# EasyEDA Pro project ProPrj_GesturePot_2025-03-16.epro

# Schematic GesPot
Board Name: GesPot; Create Date: 2025-03-15; Page Name: P2; Project Name: GesturePot; Schematic Name: GesPot; Update Date: 2025-03-15; Company: 嘉立创EDA; Page Size: A4; Version: V1.0
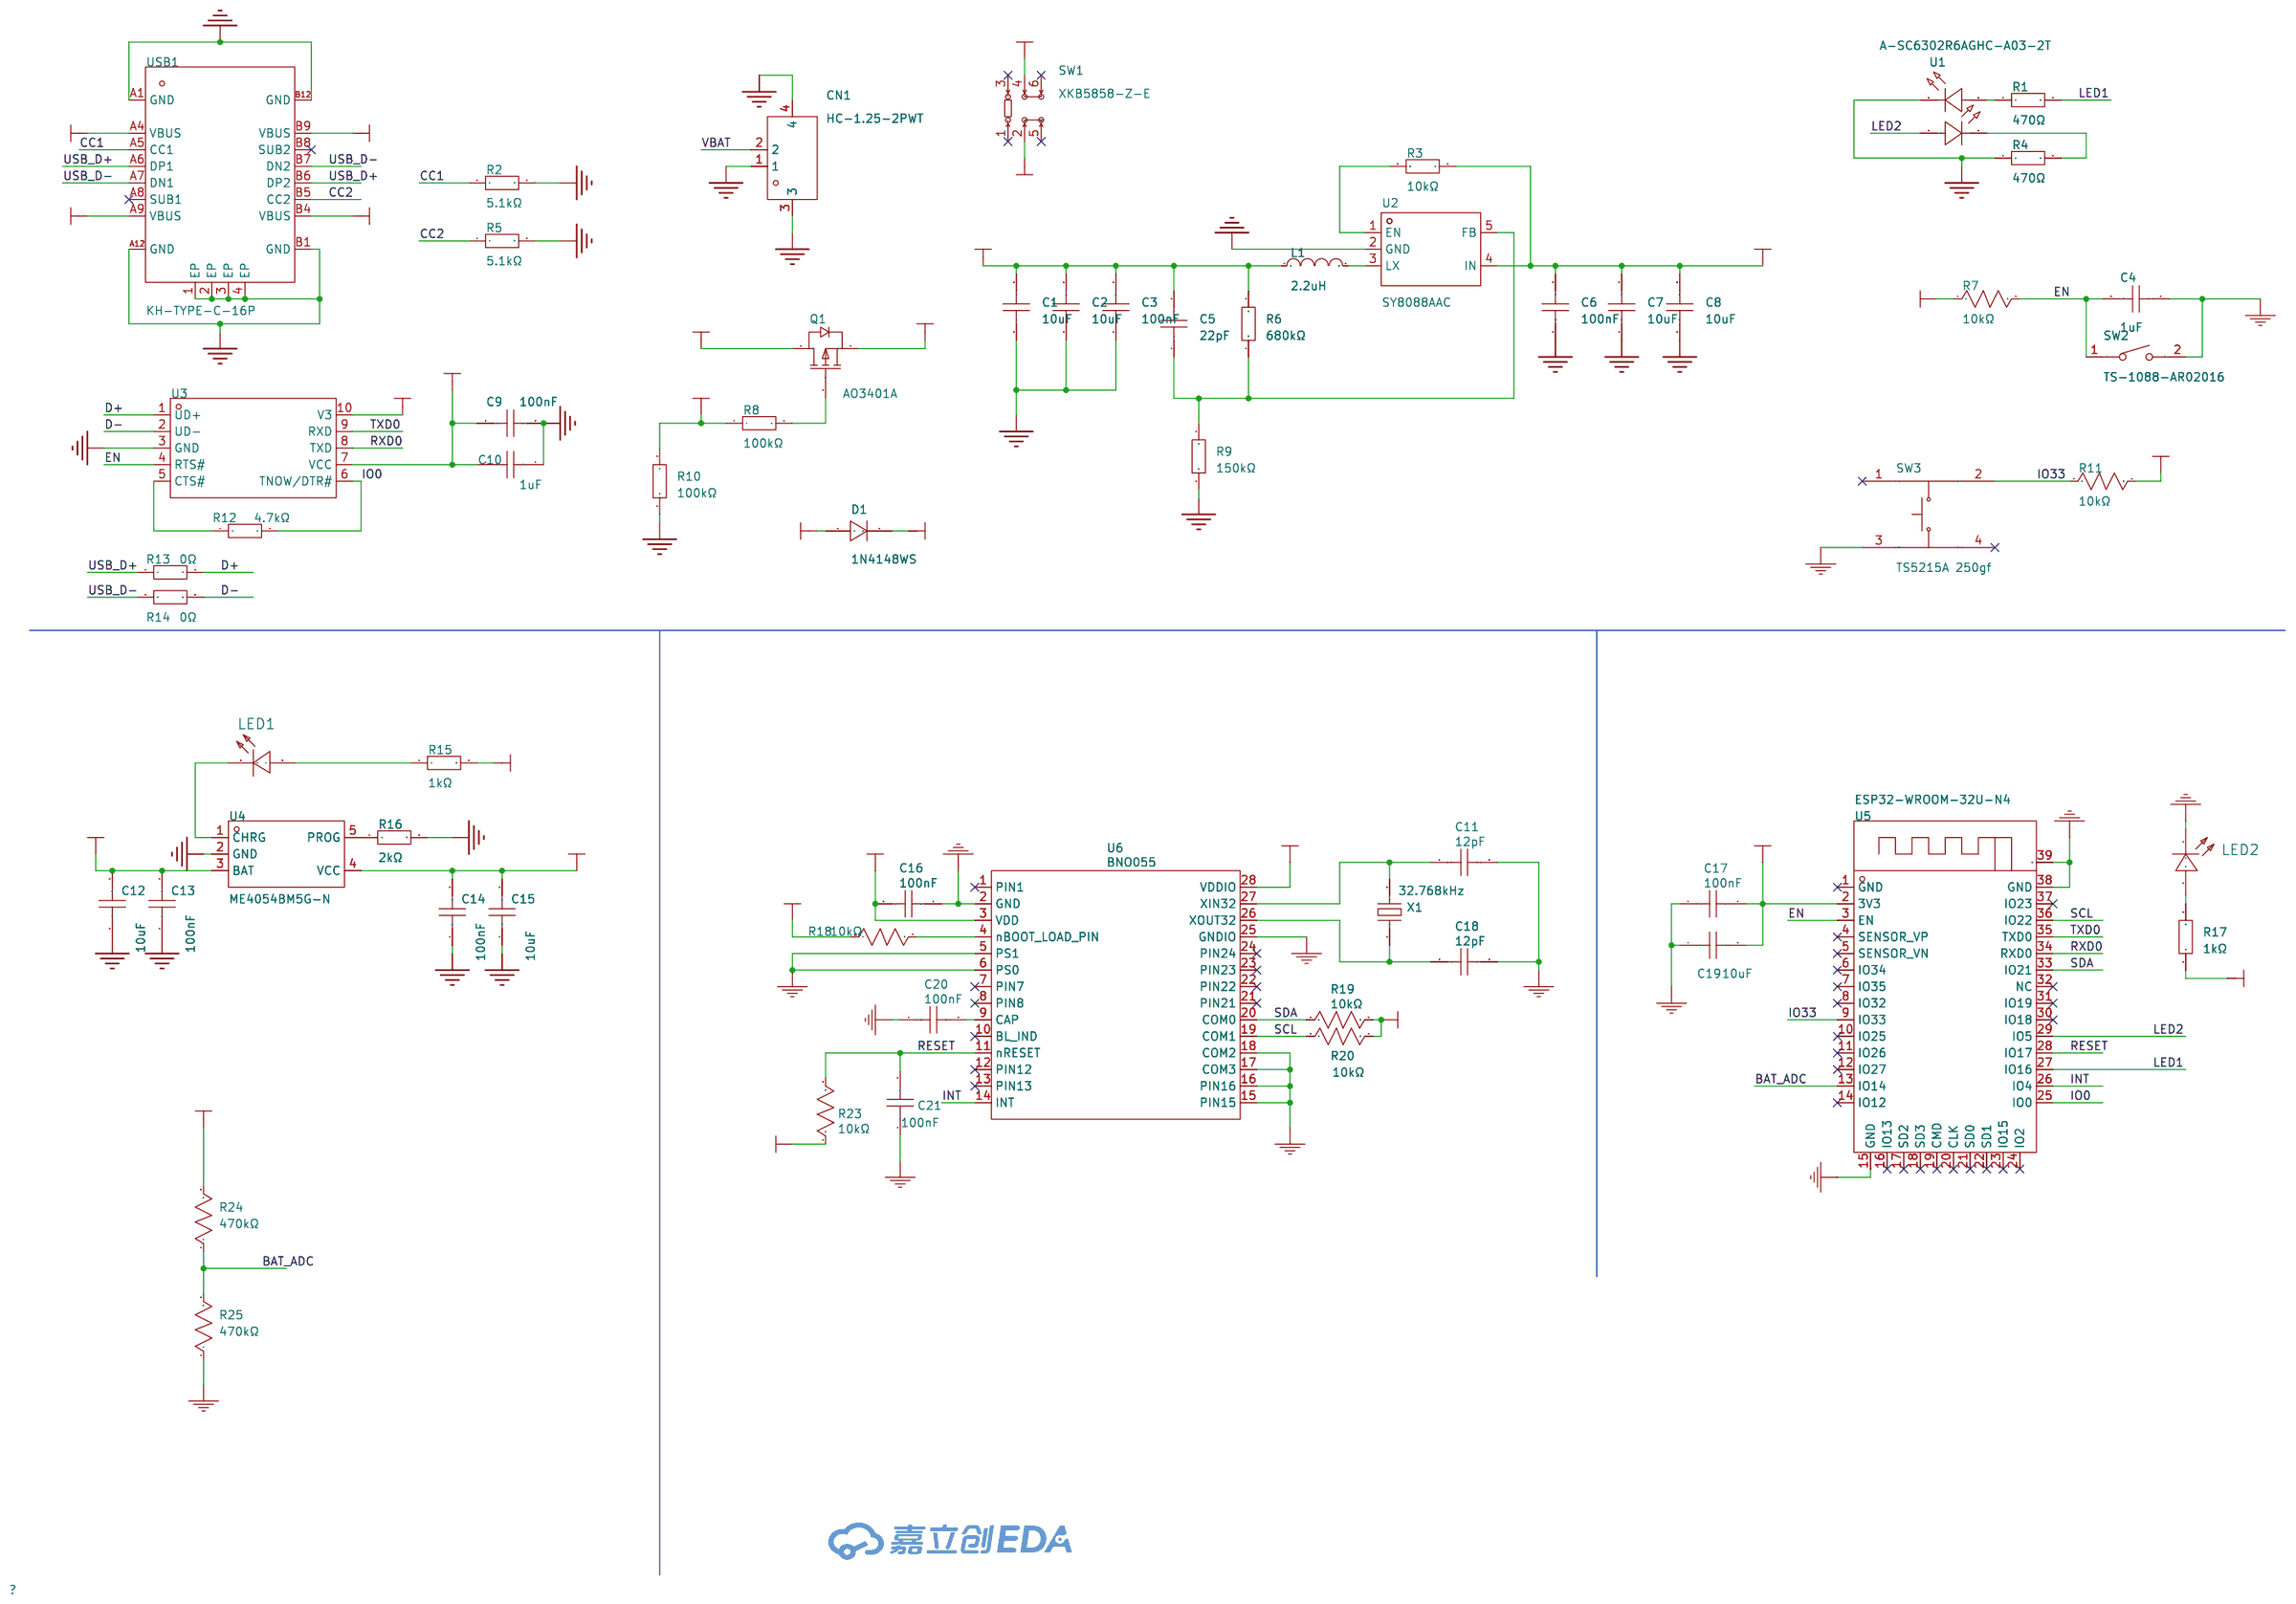
[diagram p0: schematic sheet]

## Parts
C1  10uF  [C0603]
C2  10uF  [C0603]
C3  100nF  [C0402]
C4  1uF  [C0402]
C5  22pF  [C0603]
C6  100nF  [C0402]
C7  10uF  [C0603]
C8  10uF  [C0603]
C9  100nF  [C0402]
C10  1uF  [C0402]
C11  12pF  [C0402]
C12  10uF  [C0603]
C13  100nF  [C0402]
C14  100nF  [C0402]
C15  10uF  [C0603]
C16  100nF  [C0402]
C17  100nF  [C0402]
C18  12pF  [C0402]
C19  10uF  [C0402]
C20  100nF  [C0402]
C21  100nF  [C0402]
CN1  HC-1.25-2PWT  [CONN-SMD_2P-P1.25-HC-1.25-2PWT]
D1  1N4148WS  [SOD-323_L1.8-W1.3-LS2.5-RD]
L1  2.2uH  [L0603]
LED1  KT-0603R  [LED0603-RD]
LED2  KT-0603R  [LED0603-RD]
Q1  AO3401A  [SOT-23_L2.9-W1.3-P1.90-LS2.4-BR]
R1  470Ω  [R0402]
R2  5.1kΩ  [R0402]
R3  10kΩ  [R0402]
R4  470Ω  [R0402]
R5  5.1kΩ  [R0402]
R6  680kΩ  [R0402]
R7  10kΩ  [R0402]
R8  100kΩ  [R0402]
R9  150kΩ  [R0402]
R10  100kΩ  [R0402]
R11  10kΩ  [R0402]
R12  4.7kΩ  [R0402]
R13  0Ω  [R0402]
R14  0Ω  [R0402]
R15  1kΩ  [R0402]
R16  2kΩ  [R0402]
R17  1kΩ  [R0402]
R18  10kΩ  [R0402]
R19  10kΩ  [R0402]
R20  10kΩ  [R0402]
R23  10kΩ  [R0402]
R24  470kΩ  [R0402]
R25  470kΩ  [R0402]
SW1  XKB5858-Z-E  [SW-TH_XKB5858-Z-E]
SW2  TS-1088-AR02016  [SW-SMD_L3.9-W3.0-P4.45]
SW3  TS5215A 250gf  [SW-SMD_4P-L5.2-W5.2-P3.70-LS6.4]
U1  A-SC6302R6AGHC-A03-2T  [LED-SMD_4P-L3.2-W2.8-TR_A-SC6303R6G2B1W]
U2  SY8088AAC  [SOT-23-5_L3.0-W1.7-P0.95-LS2.8-BR]
U3  CH340X  [MSOP-10_L3.0-W3.0-P0.50-LS5.0-BL]
U4  ME4054BM5G-N  [TSOT-23-5_L2.9-W1.6-P0.95-LS2.8-BL]
U5  ESP32-WROOM-32U-N4  [WIFIM-SMD_38P-L19.2-W18.0-P1.27]
U6  BNO055  [LGA-28_L5.2-W3.8-P0.50-BL]
USB1  KH-TYPE-C-16P  [USB-C-SMD_KH-TYPE-C-16P]
X1  32.768kHz  [OSC-SMD_L3.2-W1.5]

## Library data of the parts
C1 C2 C7 C8 C12 C15 = CL10A106KP8NNNC: 容值:10uF;精度:±10%;额定电压:10V;材质(温度系数):X5R;; LCSC Part Name: 10uF ±10% 10V; Supplier Part: C19702; Manufacturer: SAMSUNG(三星); Supplier Footprint: 0603; JLCPCB Part Class: Basic Part; Datasheet: https://atta.szlcsc.com/upload/public/pdf/source/20160218/1457707763339.pdf; Supplier: LCSC; Tolerance: ±10%; Voltage Rated: 10V; Temperature Coefficient: X5R
C3 C6 C13 C14 = CC0603KRX7R9BB104: 容值:100nF;精度:±10%;额定电压:50V;材质(温度系数):X7R;; LCSC Part Name: 100nF ±10% 50V; Supplier Part: C14663; Manufacturer: YAGEO(国巨); Supplier Footprint: 0603; JLCPCB Part Class: Basic Part; Datasheet: https://atta.szlcsc.com/upload/public/pdf/source/20180910/C282072_33301C7F631E79921B82A8DAC6BCC5B3.pdf; Supplier: LCSC; Tolerance: ±10%; Voltage Rated: 50V; Temperature Coefficient: X7R
C4 C10 = CL05A105KA5NQNC: 容值:1uF;精度:±10%;额定电压:25V;材质(温度系数):X5R;; LCSC Part Name: 1uF ±10% 25V; Supplier Part: C52923; Manufacturer: SAMSUNG(三星); Supplier Footprint: 0402; JLCPCB Part Class: Basic Part; Datasheet: https://atta.szlcsc.com/upload/public/pdf/source/20160218/1457707763339.pdf; Supplier: LCSC; Tolerance: ±10%; Voltage Rated: 25V; Temperature Coefficient: X5R
C5 = CL10C220JB8NNNC: 容值:22pF;精度:±5%;额定电压:50V;材质(温度系数):C0G;; LCSC Part Name: 22pF ±5% 50V; Supplier Part: C1653; Manufacturer: SAMSUNG(三星); Supplier Footprint: 0603; JLCPCB Part Class: Basic Part; Datasheet: https://atta.szlcsc.com/upload/public/pdf/source/20160218/1457707763339.pdf; Supplier: LCSC; Tolerance: ±5%; Voltage Rated: 50V; Temperature Coefficient: C0G
C9 C16 C17 C20 C21 = CL05B104KO5NNNC: 容值:100nF;精度:±10%;额定电压:16V;材质(温度系数):X7R;; LCSC Part Name: 100nF ±10% 16V; Supplier Part: C1525; Manufacturer: SAMSUNG(三星); Supplier Footprint: 0402; JLCPCB Part Class: Basic Part; Datasheet: https://atta.szlcsc.com/upload/public/pdf/source/20160218/1457707763339.pdf; Supplier: LCSC; Tolerance: ±10%; Voltage Rated: 16V; Temperature Coefficient: X7R
C11 C18 = 0402CG120J500NT: 容值:12pF;精度:±5%;额定电压:50V;材质(温度系数):C0G;; LCSC Part Name: 12pF ±5% 50V; Supplier Part: C1547; Manufacturer: FH(风华); Supplier Footprint: 0402; JLCPCB Part Class: Basic Part; Datasheet: https://atta.szlcsc.com/upload/public/pdf/source/20200305/C486355_26A10D38EF8C2A5C37091D0039909270.pdf; Supplier: LCSC; Tolerance: ±5%; Voltage Rated: 50V; Temperature Coefficient: C0G
C19 = CL05A106MQ5NUNC: 容值:10uF;精度:±20%;额定电压:6.3V;材质(温度系数):X5R;; LCSC Part Name: 10uF ±20% 6.3V; Supplier Part: C15525; Manufacturer: SAMSUNG(三星); Supplier Footprint: 0402; JLCPCB Part Class: Basic Part; Datasheet: https://atta.szlcsc.com/upload/public/pdf/source/20220823/2B02EE04F8F211D38A52DCB16EB6BEBA.pdf; Supplier: LCSC; Tolerance: ±20%; Voltage Rated: 6.3V; Temperature Coefficient: X5R
CN1 = HC-1.25-2PWT: 插针结构:1x2P;间距:1.25mm;安装方式:卧贴;参考系列:PicoBlade(MX 1.25);总PIN数:2P;排数:1;每排PIN数:2;行距:-;额定电流:1A;触头材质:黄铜;触头镀层:锡;工作温度范围:-40℃~+105℃;; LCSC Part Name: 1x2P 间距:1.25mm 卧贴 系列:PicoBlade(MX 1.25); Supplier Part: C2845379; Manufacturer: HCTL(华灿天禄); Supplier Footprint: SMD,P=1.25mm,卧贴; JLCPCB Part Class: 扩展库; Datasheet: https://atta.szlcsc.com/upload/public/pdf/source/20240930/9508A8292CCC87B0C29E3A028D56E30A.pdf; Supplier: LCSC; Pins Structure: 1x2P; Pitch: 1.25mm; Mounting Style: 卧贴; Reference Series: PicoBlade(MX 1.25); Number of Pins: 2P; Number of Rows: 1; Number of PINs Per Row: 2; Current Rating (Max): 1A; Contact Material: 黄铜; Contact Plating: 锡; Operating Temperature Range: -40℃~+105℃; Rated Voltage (Max): 125V; Plastic Material: LCP; Flame Retardant Rating: UL94V-0; Supplementary Features: 辅助焊脚; Z-Height of the Board: 3.57mm; X-Length of Bottom Edge on Board (Spacing Line): 7.55mm; Y-Width of Bottom Edge on Board: 5.25mm
D1 = 1N4148WS_C2128: 二极管配置:独立式;正向压降(Vf):1.25V@150mA;直流反向耐压(Vr):100V;整流电流:150mA;反向恢复时间(trr):4ns;; LCSC Part Name: 丝印T4; Supplier Part: C2128; Manufacturer: CJ(江苏长电/长晶); Supplier Footprint: SOD-323; JLCPCB Part Class: 基础库; Datasheet: https://atta.szlcsc.com/upload/public/pdf/source/20140809/1457707208178.pdf; Supplier: LCSC; Diode Configuration: 独立式; Forward Voltage (Vf@If): 1.25V@150mA; Reverse Voltage (Vr): 100V; Rectified Current: 150mA; Reverse Leakage Current (Ir): 1uA@75V; Reverse Recovery Time (trr): 4ns
L1 = CMH160808B2R2MT: 电感值:2.2uH;精度:±20%;额定电流:750mA;; LCSC Part Name: 2.2uH ±20%; Supplier Part: C394950; Manufacturer: FH(风华); Supplier Footprint: 0603; JLCPCB Part Class: Extended Part; Datasheet: https://atta.szlcsc.com/upload/public/pdf/source/20230223/142B566F7A79878A07A1E031813F1064.pdf; Supplier: LCSC; Tolerance: ±20%; Rated Current: 750mA; DC Resistance (DCR): 240mΩ; Ratings: AEC-Q200
LED1 LED2 = KT-0603R: 发光颜色:红色;功率:-;正向电流:-;主波长:-;二极管配置:-;透镜颜色:-;色温:-;发光角度:-;载带方式:-;工作温度:-40℃~+85℃;; LCSC Part Name: 0603 红灯 高亮; Supplier Part: C2286; Manufacturer: KENTO; Supplier Footprint: 0603; JLCPCB Part Class: Basic Part; Datasheet: https://atta.szlcsc.com/upload/public/pdf/source/20160616/1466072038404.pdf; Supplier: LCSC; Emitted Color: 红色; Operating Temperature: -40℃~+85℃
Q1 = AO3401A_C15127: 类型:1个P沟道;漏源电压(Vdss):30V;连续漏极电流(Id):4A;导通电阻(RDS(on)@Vgs,Id):44mΩ@10V,4.3A;功率(Pd):1.4W;阈值电压(Vgs(th)@Id):1.3V@250uA;; LCSC Part Name: 1个P沟道 耐压:30V 电流:4A; Supplier Part: C15127; Manufacturer: AOS; Supplier Footprint: SOT-23; JLCPCB Part Class: 基础库; Datasheet: https://atta.szlcsc.com/upload/public/pdf/source/20160507/1462613609053.pdf; Supplier: LCSC; Type: 1个P沟道; Drain Source Voltage (Vdss): 30V; Continuous Drain Current (Id): 4A; Drain Source On Resistance (RDS(on)@Vgs,Id): 44mΩ@10V,4.3A; Power Dissipation (Pd): 1.4W; Gate Threshold Voltage (Vgs(th)@Id): 1.3V@250uA; Total Gate Charge (Qg@Vgs): 12.2nC@4.5V; Input Capacitance (Ciss@Vds): 1.2nF@15V; Operating Temperature: -55℃~+150℃@(Tj)
R1 R4 = 0402WGF4700TCE: 电阻类型:厚膜电阻;阻值:470Ω;精度:±1%;功率:62.5mW;最大工作电压:50V;温度系数:±100ppm/℃;; LCSC Part Name: 470Ω ±1% 62.5mW 厚膜电阻; Supplier Part: C25117; Manufacturer: UNI-ROYAL(厚声); Supplier Footprint: 0402; JLCPCB Part Class: Basic Part; Datasheet: https://atta.szlcsc.com/upload/public/pdf/source/20200306/C422600_1E6D84923E4A46A82E41ADD87F860B5C.pdf; Supplier: LCSC; Type: 厚膜电阻; Tolerance: ±1%; Power(Watts): 62.5mW; Overload Voltage (Max): 50V; Temperature Coefficient: ±100ppm/℃; Operating Temperature Range: -55℃~+155℃
R2 R5 = 0402WGF5101TCE: 电阻类型:厚膜电阻;阻值:5.1kΩ;精度:±1%;功率:62.5mW;最大工作电压:50V;温度系数:±100ppm/℃;; LCSC Part Name: 5.1kΩ ±1% 62.5mW 厚膜电阻; Supplier Part: C25905; Manufacturer: UNI-ROYAL(厚声); Supplier Footprint: 0402; JLCPCB Part Class: Basic Part; Datasheet: https://atta.szlcsc.com/upload/public/pdf/source/20200306/C422600_1E6D84923E4A46A82E41ADD87F860B5C.pdf; Supplier: LCSC; Type: 厚膜电阻; Tolerance: ±1%; Power(Watts): 62.5mW; Overload Voltage (Max): 50V; Temperature Coefficient: ±100ppm/℃; Operating Temperature Range: -55℃~+155℃
R3 R7 R11 R18-R20 R23 = 0402WGF1002TCE: 电阻类型:厚膜电阻;阻值:10kΩ;精度:±1%;功率:62.5mW;最大工作电压:50V;温度系数:±100ppm/℃;; LCSC Part Name: 10kΩ ±1% 62.5mW 厚膜电阻; Supplier Part: C25744; Manufacturer: UNI-ROYAL(厚声); Supplier Footprint: 0402; JLCPCB Part Class: Basic Part; Datasheet: https://atta.szlcsc.com/upload/public/pdf/source/20200306/C422600_1E6D84923E4A46A82E41ADD87F860B5C.pdf; Supplier: LCSC; Type: 厚膜电阻; Tolerance: ±1%; Power(Watts): 62.5mW; Overload Voltage (Max): 50V; Temperature Coefficient: ±100ppm/℃; Operating Temperature Range: -55℃~+155℃
R6 = RC0402FR-07680KL: 电阻类型:厚膜电阻;阻值:680kΩ;精度:±1%;功率:62.5mW;最大工作电压:50V;温度系数:±100ppm/℃;; LCSC Part Name: 厚膜电阻 680kΩ ±1% 62.5mW; Supplier Part: C163456; Manufacturer: YAGEO(国巨); Supplier Footprint: 0402; JLCPCB Part Class: Extended Part; Datasheet: https://atta.szlcsc.com/upload/public/pdf/source/20181009/C309620_DA5935B6E1D48212CB7A533FE518B3C2.pdf; Supplier: LCSC; Type: 厚膜电阻; Tolerance: ±1%; Power(Watts): 62.5mW; Overload Voltage (Max): 50V; Temperature Coefficient: ±100ppm/℃; Operating Temperature Range: -55℃~+155℃
R8 R10 = 0402WGF1003TCE: 电阻类型:厚膜电阻;阻值:100kΩ;精度:±1%;功率:62.5mW;最大工作电压:50V;温度系数:±100ppm/℃;; LCSC Part Name: 100kΩ ±1% 62.5mW 厚膜电阻; Supplier Part: C25741; Manufacturer: UNI-ROYAL(厚声); Supplier Footprint: 0402; JLCPCB Part Class: Basic Part; Datasheet: https://atta.szlcsc.com/upload/public/pdf/source/20200306/C422600_1E6D84923E4A46A82E41ADD87F860B5C.pdf; Supplier: LCSC; Type: 厚膜电阻; Tolerance: ±1%; Power(Watts): 62.5mW; Overload Voltage (Max): 50V; Temperature Coefficient: ±100ppm/℃; Operating Temperature Range: -55℃~+155℃
R9 = 0402WGF1503TCE: 电阻类型:厚膜电阻;阻值:150kΩ;精度:±1%;功率:62.5mW;最大工作电压:50V;温度系数:±100ppm/℃;; LCSC Part Name: 150kΩ ±1% 62.5mW 厚膜电阻; Supplier Part: C25755; Manufacturer: UNI-ROYAL(厚声); Supplier Footprint: 0402; JLCPCB Part Class: Extended Part; Datasheet: https://atta.szlcsc.com/upload/public/pdf/source/20200306/C422600_1E6D84923E4A46A82E41ADD87F860B5C.pdf; Supplier: LCSC; Type: 厚膜电阻; Tolerance: ±1%; Power(Watts): 62.5mW; Overload Voltage (Max): 50V; Temperature Coefficient: ±100ppm/℃; Operating Temperature Range: -55℃~+155℃
R12 = 0402WGF4701TCE: 电阻类型:厚膜电阻;阻值:4.7kΩ;精度:±1%;功率:62.5mW;最大工作电压:50V;温度系数:±100ppm/℃;; LCSC Part Name: 4.7kΩ ±1% 62.5mW 厚膜电阻; Supplier Part: C25900; Manufacturer: UNI-ROYAL(厚声); Supplier Footprint: 0402; JLCPCB Part Class: Basic Part; Datasheet: https://atta.szlcsc.com/upload/public/pdf/source/20200306/C422600_1E6D84923E4A46A82E41ADD87F860B5C.pdf; Supplier: LCSC; Type: 厚膜电阻; Tolerance: ±1%; Power(Watts): 62.5mW; Overload Voltage (Max): 50V; Temperature Coefficient: ±100ppm/℃; Operating Temperature Range: -55℃~+155℃
R13 R14 = 0402WGF0000TCE: 电阻类型:厚膜电阻;阻值:0Ω;精度:±1%;功率:62.5mW;最大工作电压:50V;温度系数:±800ppm/℃;; LCSC Part Name: 0Ω ±1% 62.5mW 厚膜电阻; Supplier Part: C17168; Manufacturer: UNI-ROYAL(厚声); Supplier Footprint: 0402; JLCPCB Part Class: Basic Part; Datasheet: https://atta.szlcsc.com/upload/public/pdf/source/20200306/C422600_1E6D84923E4A46A82E41ADD87F860B5C.pdf; Supplier: LCSC; Type: 厚膜电阻; Tolerance: ±1%; Power(Watts): 62.5mW; Overload Voltage (Max): 50V; Temperature Coefficient: ±800ppm/℃; Operating Temperature Range: -55℃~+155℃
R15 R17 = 0402WGF1001TCE: 电阻类型:厚膜电阻;阻值:1kΩ;精度:±1%;功率:62.5mW;最大工作电压:50V;温度系数:±100ppm/℃;; LCSC Part Name: 1kΩ ±1% 62.5mW 厚膜电阻; Supplier Part: C11702; Manufacturer: UNI-ROYAL(厚声); Supplier Footprint: 0402; JLCPCB Part Class: Basic Part; Datasheet: https://atta.szlcsc.com/upload/public/pdf/source/20200306/C422600_1E6D84923E4A46A82E41ADD87F860B5C.pdf; Supplier: LCSC; Type: 厚膜电阻; Tolerance: ±1%; Power(Watts): 62.5mW; Overload Voltage (Max): 50V; Temperature Coefficient: ±100ppm/℃; Operating Temperature Range: -55℃~+155℃
R16 = 0402WGF2001TCE: 电阻类型:厚膜电阻;阻值:2kΩ;精度:±1%;功率:62.5mW;最大工作电压:50V;温度系数:±100ppm/℃;; LCSC Part Name: 2kΩ ±1% 62.5mW 厚膜电阻; Supplier Part: C4109; Manufacturer: UNI-ROYAL(厚声); Supplier Footprint: 0402; JLCPCB Part Class: Basic Part; Datasheet: https://atta.szlcsc.com/upload/public/pdf/source/20200306/C422600_1E6D84923E4A46A82E41ADD87F860B5C.pdf; Supplier: LCSC; Type: 厚膜电阻; Tolerance: ±1%; Power(Watts): 62.5mW; Overload Voltage (Max): 50V; Temperature Coefficient: ±100ppm/℃; Operating Temperature Range: -55℃~+155℃
R24 R25 = 0402WGF4703TCE: 电阻类型:厚膜电阻;阻值:470kΩ;精度:±1%;功率:62.5mW;最大工作电压:50V;温度系数:±100ppm/℃;; LCSC Part Name: 470kΩ ±1% 62.5mW 厚膜电阻; Supplier Part: C25790; Manufacturer: UNI-ROYAL(厚声); Supplier Footprint: 0402; JLCPCB Part Class: Extended Part; Datasheet: https://atta.szlcsc.com/upload/public/pdf/source/20200306/C422600_1E6D84923E4A46A82E41ADD87F860B5C.pdf; Supplier: LCSC; Type: 厚膜电阻; Tolerance: ±1%; Power(Watts): 62.5mW; Overload Voltage (Max): 50V; Temperature Coefficient: ±100ppm/℃; Operating Temperature Range: -55℃~+155℃
SW1 = XKB5858-Z-E: 自锁/无锁:自锁;安装方式:卧插;触点电流:100mA;额定电压 (AC):250V;额定电压 (DC):30V;带灯:不带;作用力:2.5N;机械寿命:10万次;; Supplier Part: C780038; Manufacturer: XKB Connection(中国星坤); Supplier Footprint: 插件; JLCPCB Part Class: 扩展库; Datasheet: https://atta.szlcsc.com/upload/public/pdf/source/20211011/56D3FA9FC185EAC41365C3B37B684CC1.pdf; Supplier: LCSC; Self Lock / No Lock: 自锁; Actuator Style: 方形按钮; Mounting Style: 卧插; Contact Current: 100mA; Voltage Rating (AC): 250V; Voltage Rating (DC): 30V; Insulation Resistance: 100MΩ; Actuator/Cap Color: 白色; With Lamp: 不带; Pin Style: PC引脚; Operating Force: 2.5N; Operating Temperature: -15℃~+55℃; Mechanical Life: 10万次
SW2 = TS-1088-AR02016: 电路结构:单刀单掷;按钮形状:圆形按钮;作用力:160gf;安装方式:立贴;开关长度:4mm;开关宽度:3mm;开关高度:2mm;带支架:不带;触点电流:50mA;额定电压(DC):12V;绝缘电阻:100MΩ;机械寿命:10万次;; LCSC Part Name: 4*3*2mm 立贴 轻触开关; Supplier Part: C720477; Manufacturer: XUNPU(讯普); Supplier Footprint: SMD; JLCPCB Part Class: 扩展库; Datasheet: https://atta.szlcsc.com/upload/public/pdf/source/20200810/C720475_60D09DD6C54279ADDB2DC25100F1CC11.pdf; Supplier: LCSC; Circuit: 单刀单掷; Actuator Style: 圆形按钮; Operating Force: 160gf; Mounting Style: 立贴; Switch Length: 4mm; Switch Width: 3mm; Switch Height: 2mm; Strike Gundam: 不带; Contact Current: 50mA; Voltage Rating (DC): 12V; Insulation Resistance: 100MΩ; Actuator/Cap Color: 黑色; Pin Style: SMD接片; Mechanical Life: 10万次; Operating Temperature: -30℃~+80℃
SW3 = TS5215A 250gf: 电路结构:单刀单掷;按钮形状:圆形按钮;安装方式:立贴;开关长度:5.2mm;开关宽度:5.2mm;触点电流:50mA;额定电压(DC):12V;带灯:-;机械寿命:-;; LCSC Part Name: 轻触开关 5.2*5.2*1.5mm 250gf 4*4铜头; Supplier Part: C388295; Manufacturer: SHOU HAN(首韩); Supplier Footprint: SMD; JLCPCB Part Class: 扩展库; Datasheet: https://atta.szlcsc.com/upload/public/pdf/source/20190424/C388295_31A82B96127B687D36F6ABA2DD1EA95B.pdf; Supplier: LCSC; Circuit: 单刀单掷; Actuator Style: 圆形按钮; Mounting Style: 立贴; Switch Length: 5.2mm; Switch Width: 5.2mm; Contact Current: 50mA; Voltage Rating (DC): 12V
U1 = A-SC6302R6AGHC-A03-2T: 发光颜色:红色,绿色;功率:95mW；120mW;主波长:515nm~530nm；622nm;透镜颜色:无色透明透镜;发光强度:565mcd~1120mcd；1420mcd~2250mcd;发光角度:120°;载带方式:正贴;工作温度:-40℃~+85℃;; LCSC Part Name: 3528红绿双色正贴; Supplier Part: C5355456; Manufacturer: Amicc(欧密格光电); Supplier Footprint: SMD-4P,3.5x2.8mm; JLCPCB Part Class: 扩展库; Datasheet: https://atta.szlcsc.com/upload/public/pdf/source/20230314/98A915D35223BAB3AE4A54526115EEEC.pdf; Supplier: LCSC; Emitted Color: 红色,绿色; Power Dissipation: 95mW；120mW; Dominant Wavelength: 515nm~530nm；622nm; Lens Color: 无色透明透镜; Luminous Intensity: 565mcd~1120mcd；1420mcd~2250mcd; Viewing Angle: 120°; Mounting Sytle: 正贴; Operating Temperature: -40℃~+85℃
U2 = SY8088AAC: 功能类型:降压型;输出类型:-;工作电压:2.5V~5.5V;输出电压:-;输出电流:-;; LCSC Part Name: 1.5MHz 1A 同步降压DC/DC调节器; Supplier Part: C79313; Manufacturer: silergy(矽力杰); Supplier Footprint: SOT-23-5; JLCPCB Part Class: 扩展库; Datasheet: https://atta.szlcsc.com/upload/public/pdf/source/20170329/1490752163260.pdf; Supplier: LCSC; Function: 降压型; Input Voltage: 2.5V~5.5V; Switching Frequency: 1.5MHz; Operating Temperature: -40℃~+125℃; Synchronous Rectification: 是; Number of Outputs: 1; Topology: 降压式; Quiescent Current (Iq): 40uA
U3 = CH340X: Supplier Part: C3035748; Manufacturer: WCH(南京沁恒); Supplier Footprint: MSOP-10; JLCPCB Part Class: 扩展库; Datasheet: https://atta.szlcsc.com/upload/public/pdf/source/20230530/6E401E9554E9F5311886CC8B3F89B62E.pdf; Supplier: LCSC
U4 = ME4054BM5G-N: Supplier Part: C478383; Manufacturer: MICRONE(南京微盟); Supplier Footprint: SOT-23-5; JLCPCB Part Class: 扩展库; Datasheet: https://atta.szlcsc.com/upload/public/pdf/source/20191226/C478383_334A5ED125CA9F8F85F7DE0AC0ECFE6D.pdf; Supplier: LCSC
U5 = ESP32-WROOM-32U-N4_C328062: 通用型Wi-Fi+BT+BLE MCU模组; LCSC Part Name: 通用型Wi-Fi+BT+BLE MCU模组; Supplier Part: C328062; Manufacturer: ESPRESSIF(乐鑫); Supplier Footprint: SMD,18x19.2mm; JLCPCB Part Class: 扩展库; Datasheet: https://atta.szlcsc.com/upload/public/pdf/source/20241030/FABBD8327B67EE0A7C31EF04AF2F47D2.pdf; Supplier: LCSC
U6 = BNO055: Supplier: LCSC; Supplier Part: C93216; Manufacturer: Bosch(博世); JLCPCB Part Class: Extended Part; Contributor: LCSC; spicePre: U
USB1 = KH-TYPE-C-16P: 连接器类型:Type-C;标准:-;公母:母;端口数量:1;触点数量:16P;安装方式:卧贴;额定电流 - 电源:3A;工作温度范围:-40℃~+85℃;; LCSC Part Name: Type-C 母 卧贴; Supplier Part: C709357; Manufacturer: kinghelm(金航标); Supplier Footprint: SMD; JLCPCB Part Class: 扩展库; Datasheet: https://atta.szlcsc.com/upload/public/pdf/source/20200911/C709357_AA8DCEB38BB20E3035A7ED7AE7667837.pdf; Supplier: LCSC; Connector Type: Type-C; Gender: 母; Number of Ports: 1; Number of Contacts: 16P; Mounting Style: 卧贴; Current Rating - Power (Max): 3A; Operating Temperature Range: -40℃~+85℃
X1 = X321532768KGD2SI: 晶振类型:贴片晶振;频率:32.768kHz;常温频差:±20ppm;外接负载电容:12.5pF;频率稳定度(全温):-;; LCSC Part Name: 32.768kHz ±20ppm 12.5pF; Supplier Part: C620155; Manufacturer: YXC(扬兴晶振); Supplier Footprint: SMD3215-2P; JLCPCB Part Class: 扩展库; Datasheet: https://atta.szlcsc.com/upload/public/pdf/source/20240329/3A7650FD985DD0DE85694D3785AB4916.pdf; Supplier: LCSC; Crystal Type: 贴片晶振; Normal temperature Frequency Tolerance: ±20ppm; External load capacitor: 12.5pF; Operating Temperature: -40℃~+85℃

## Nets
GND: C1.1 C2.1 C3.1 C4.1 C6.1 C7.1 C8.1 C9.2 C10.2 C11.2 C12.1 C13.1 C14.1 C15.1 C16.1 C17.1 C18.2 C19.1 C20.1 C21.1 CN1.1 CN1.3 CN1.4 LED2.1(K) R2.2 R4.1 R5.2 R9.2 R10.1 R16.2 R25.1 SW2.2 SW3.3 U1.2(-) U2.2(GND) U3.3(GND) U4.2(GND) U5.15(GND) U5.38(GND) U5.39(GND) U6.2(GND) U6.5(PS1) U6.6(PS0) U6.15(PIN15) U6.16(PIN16) U6.17(COM3) U6.18(COM2) U6.25(GNDIO) USB1.1(EP) USB1.2(EP) USB1.3(EP) USB1.4(EP) USB1.A1(GND) USB1.A12(GND) USB1.B1(GND) USB1.B12(GND)
VBAT: C12.2 C13.2 CN1.2 R24.2 SW1.2 U4.3(BAT)
VBAT_IN: Q1.3(D) SW1.4
VBUS: D1.2(A) R8.1 R10.2 USB1.A4(VBUS) USB1.A9(VBUS) USB1.B4(VBUS) USB1.B9(VBUS)
VCC_3V3: C1.2 C2.2 C3.2 C5.2 C9.1 C10.1 C16.2 C17.2 C19.2 L1.1 R6.2 R7.1 R11.2 R17.1 R18.1 R19.2 R20.2 R23.1 U3.7(VCC) U3.10(V3) U5.2(3V3) U6.3(VDD) U6.28(VDDIO)
VDD: C6.2 C7.2 C8.2 D1.1(K) Q1.2(S) R3.1 U2.4(IN)
BAT_ADC: R24.1 R25.2 U5.13(IO14)
CC1: R2.1 USB1.A5(CC1)
CC2: R5.1 USB1.B5(CC2)
D+: R13.2 U3.1(UD+)
D-: R14.2 U3.2(UD-)
EN: C4.2 R7.2 SW2.1 U3.4(RTS#) U5.3(EN)
INT: U5.26(IO4) U6.14(INT)
IO0: R12.2 U3.6(TNOW/DTR#) U5.25(IO0)
IO33: R11.1 SW3.2 U5.9(IO33)
LED1: R1.2 U5.27(IO16)
LED2: U1.1(+) U5.29(IO5)
RESET: C21.2 R23.2 U5.28(IO17) U6.11(nRESET)
RXD0: U3.8(TXD) U5.34(RXD0)
SCL: R20.1 U5.36(IO22) U6.19(COM1)
SDA: R19.1 U5.33(IO21) U6.20(COM0)
TXD0: U3.9(RXD) U5.35(TXD0)
USB_D+: R13.1 USB1.A6(DP1) USB1.B6(DP2)
USB_D-: R14.1 USB1.A7(DN1) USB1.B7(DN2)
VUSB: C14.2 C15.2 R15.2 U4.4(VCC)
$2N9985: C11.1 U6.27(XIN32) X1.2
$2N9991: C18.1 U6.26(XOUT32) X1.1
$2N10003: C20.2 U6.9(CAP)
$2N10010: R18.2 U6.4(nBOOT_LOAD_PIN)
$2N10051: R12.1 U3.5(CTS#)
$2N10058: LED1.1(K) U4.1(CHRG)
$2N10059: LED1.2(A) R15.1
$2N10065: R16.1 U4.5(PROG)
$2N10075: L1.2 U2.3(LX)
$2N10079: C5.1 R6.1 R9.1 U2.5(FB)
$2N10081: R3.2 U2.1(EN)
$2N10082: Q1.1(G) R8.2
$2N10121: LED2.2(A) R17.2
$2N14287: R1.1 U1.3(+)
$2N14330: R4.2 U1.4(-)

Not connected (* = marked no-connect by the designer): SW1 1* 3* 5* 6*; SW3 1* 4*; U5 1(GND)* 4(SENSOR_VP)* 5(SENSOR_VN)* 6(IO34)* 7(IO35)* 8(IO32)* 10(IO25)* 11(IO26)* 12(IO27)* 14(IO12)* 16(IO13)* 17(SD2)* 18(SD3)* 19(CMD)* 20(CLK)* 21(SD0)* 22(SD1)* 23(IO15)* 24(IO2)* 30(IO18)* 31(IO19)* 32(NC)* 37(IO23)*; U6 1(PIN1)* 7(PIN7)* 8(PIN8)* 10(BL_IND)* 12(PIN12)* 13(PIN13)* 21(PIN21)* 22(PIN22)* 23(PIN23)* 24(PIN24)*; USB1 A8(SUB1)* B8(SUB2)*

# Board PCB6
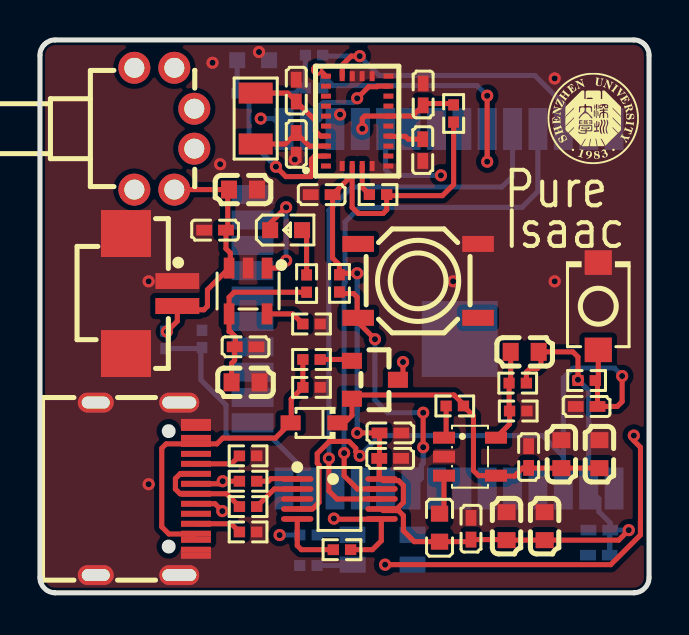
[diagram p1: board, top side]
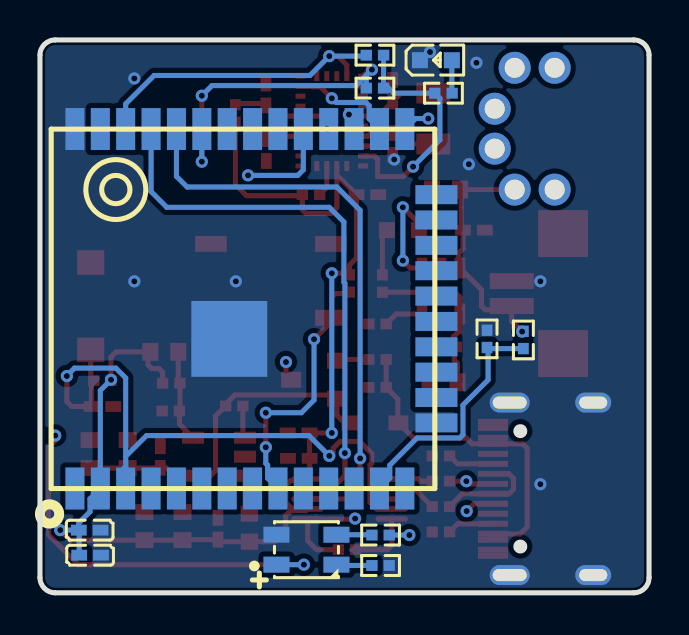
[diagram p2: board, bottom side, seen from below]

Outline 30.48 x 27.69 mm; copper layers: Top Layer, Inner1, Inner2, Bottom Layer. Coordinates in mm from the lower left corner of the outline.
Outline path: 0,26.92 0,0.76 arc(0.22,0.22) 0.76,0 29.72,0 arc(30.26,0.22) 30.48,0.76 30.48,26.92 arc(30.26,27.46) 29.72,27.69 0.76,27.69 arc(0.22,27.46) 0,26.92
Stack: Top Layer 0.035mm 外层铜厚1oz / Dielectric1 0.2104mm 7628 RC49% 8.6mil / Inner1 0.0152mm 内层铜厚 / Dielectric2 1.065mm 1.1mm H/HOZ Copper / Inner2 0.0152mm 内层铜厚 / Dielectric3 0.2104mm 7628 RC49% 8.6mil / Bottom Layer 0.035mm 外层铜厚1oz

## Design rules (mm)
net USB_D+: DP1
net USB_D-: DP1
template: 自定义配置
spacing copperThickness1oz (default): track to track 0.102, other pairs 0.152 to 0.3
spacing copperThickness2oz: track to track 0.203, other pairs 0.152 to 0.3
track width copperThickness1oz (default): min 0.127, default 0.254, max 2.54
track width copperThickness2oz: min 0.203, default 0.254, max 2.54
differential pair differentialPair (default): width min 0.127, default 0.254, max 2.54; gap min 0.152, default 0.152
via viaSize (default): diameter min 0.5, default 0.61, max 10; hole min 0.3, default 0.305, max 6.3

## Placement (name value [footprint] x y rotation side)
C1  10uF  [C0603]  23.35 3.34 270 top
C2  10uF  [C0603]  25.25 3.34 270 top
C3  100nF  [C0402]  21.57 3.21 270 top
C4  1uF  [C0402]  27.36 9.33 0 top
C5  22pF  [C0603]  24.26 12.06 0 top
C6  100nF  [C0402]  24.46 6.8 270 top
C7  10uF  [C0603]  26.09 6.94 270 top
C8  10uF  [C0603]  28 6.94 270 top
C9  100nF  [C0402]  17.53 6.73 0 top
C10  1uF  [C0402]  17.54 8.01 0 top
C11  12pF  [C0402]  12.83 22.48 270 top
C12  10uF  [C0603]  10.16 20.19 180 top
C13  100nF  [C0402]  8.76 18.16 0 top
C14  100nF  [C0402]  10.29 12.32 180 top
C15  10uF  [C0603]  10.29 10.54 180 top
C16  100nF  [C0402]  14.1 19.94 0 top
C17  100nF  [C0402]  27.97 1.88 0 bottom
C18  12pF  [C0402]  12.83 25.15 90 top
C19  10uF  [C0402]  27.99 3.14 0 bottom
C20  100nF  [C0402]  19.15 22.17 90 top
C21  100nF  [C0402]  19.18 24.96 270 top
CN1  HC-1.25-2PWT  [CONN-SMD_2P-P1.25-HC-1.25-2PWT]  5.59 14.99 270 top
D1  1N4148WS  [SOD-323_L1.8-W1.3-LS2.5-RD]  13.72 8.51 180 top
L1  2.2uH  [L0603]  20 3.26 90 top
LED1  KT-0603R  [LED0603-RD]  12.32 18.16 0 top
LED2  KT-0603R  [LED0603-RD]  10.67 26.67 180 bottom
Q1  AO3401A  [SOT-23_L2.9-W1.3-P1.90-LS2.4-BR]  16.76 10.67 180 top
R1  470Ω  [R0402]  13.44 2.89 180 bottom
R2  5.1kΩ  [R0402]  10.41 6.86 0 top
R3  10kΩ  [R0402]  20.76 9.36 180 top
R4  470Ω  [R0402]  13.44 1.37 0 bottom
R5  5.1kΩ  [R0402]  10.41 3.05 0 top
R6  680kΩ  [R0402]  23.91 10.5 0 top
R7  10kΩ  [R0402]  27.36 10.63 0 top
R8  100kΩ  [R0402]  13.59 11.68 0 top
R9  150kΩ  [R0402]  23.93 9.1 0 top
R10  100kΩ  [R0402]  13.59 10.29 180 top
R11  10kΩ  [R0402]  14.99 15.49 90 top
R12  4.7kΩ  [R0402]  15.11 2.16 0 top
R13  0Ω  [R0402]  10.41 5.59 0 top
R14  0Ω  [R0402]  10.41 4.32 0 top
R15  1kΩ  [R0402]  13.34 15.49 270 top
R16  2kΩ  [R0402]  13.59 13.46 0 top
R17  1kΩ  [R0402]  10.29 25.02 180 bottom
R18  10kΩ  [R0402]  16.92 19.94 180 top
R19  10kΩ  [R0402]  13.72 25.27 180 bottom
R20  10kΩ  [R0402]  13.72 26.92 180 bottom
R23  10kΩ  [R0402]  20.7 24 90 top
R24  470kΩ  [R0402]  6.29 12.66 90 bottom
R25  470kΩ  [R0402]  8.11 12.72 270 bottom
SW1  XKB5858-Z-E  [SW-TH_XKB5858-Z-E]  6.22 23.24 90 top
SW2  TS-1088-AR02016  [SW-SMD_L3.9-W3.0-P4.45]  27.94 14.35 90 top
SW3  TS5215A 250gf  [SW-SMD_4P-L5.2-W5.2-P3.70-LS6.4]  18.92 15.62 180 top
U1  A-SC6302R6AGHC-A03-2T  [LED-SMD_4P-L3.2-W2.8-TR_A-SC6303R6G2B1W]  17.15 2.16 0 bottom
U2  SY8088AAC  [SOT-23-5_L3.0-W1.7-P0.95-LS2.8-BR]  21.52 6.82 180 top
U3  CH340X  [MSOP-10_L3.0-W3.0-P0.50-LS5.0-BL]  14.99 4.7 270 top
U4  ME4054BM5G-N  [TSOT-23-5_L2.9-W1.6-P0.95-LS2.8-BL]  10.41 15.11 180 top
U5  ESP32-WROOM-32U-N4  [WIFIM-SMD_38P-L19.2-W18.0-P1.27]  19.69 14.22 0 bottom
U6  BNO055  [LGA-28_L5.2-W3.8-P0.50-BL]  15.88 23.62 0 top
USB1  KH-TYPE-C-16P  [USB-C-SMD_KH-TYPE-C-16P]  5.21 5.21 270 top
X1  32.768kHz  [OSC-SMD_L3.2-W1.5]  10.8 23.75 270 top

## Footprints (pads in the part's own frame, mm; a bottom-side part is the same pattern mirrored in y, then rotated)
C0402
  rect 0.79x0.54 smd: 1(-0.545,0) 2(0.545,0)
C0603
  rect 0.8x0.9 smd: 1(-0.7,0) 2(0.7,0)
CONN-SMD_2P-P1.25-HC-1.25-2PWT
  rect 0.8x2.2 smd: 1(-0.625,1.285) 2(0.625,1.285)
  rect 2.35x2.5 smd: 3(-3.005,-1.285) 4(3.005,-1.285)
L0603
  rect 0.8x0.864 smd: 1(-0.7,0) 2(0.7,0)
LED0603-RD
  rect 0.8x0.8 smd: 1(-0.799,0) 2(0.799,0)
LED-SMD_4P-L3.2-W2.8-TR_A-SC6303R6G2B1W
  rect 1.3x0.8 smd: 1(1.5,0.75) 2(1.5,-0.75) 3(-1.5,-0.75) 4(-1.5,0.75)
LGA-28_L5.2-W3.8-P0.50-BL
  rect 0.5x0.25 smd: 1(-1.563,-2.25) 6(1.563,-2.25) 7(1.563,-1.75) 8(1.563,-1.25) 9(1.563,-0.75) 10(1.563,-0.25) 11(1.563,0.25) 12(1.563,0.75) 13(1.563,1.25) 14(1.563,1.75) 15(1.563,2.25) 20(-1.563,2.25) 21(-1.563,1.75) 22(-1.563,1.25) 23(-1.563,0.75) 24(-1.563,0.25) 25(-1.563,-0.25) 26(-1.563,-0.75) 27(-1.563,-1.25) 28(-1.563,-1.75)
  rect 0.25x0.5 smd: 2(-0.75,-2.25) 3(-0.25,-2.25) 4(0.25,-2.25) 5(0.75,-2.25) 16(0.75,2.25) 17(0.25,2.25) 18(-0.25,2.25) 19(-0.75,2.25)
MSOP-10_L3.0-W3.0-P0.50-LS5.0-BL
  oval 0.28x1.62 smd: 1(-1,-2.11) 2(-0.5,-2.11) 3(0,-2.11) 4(0.5,-2.11) 5(1,-2.11) 6(1,2.11) 7(0.5,2.11) 8(0,2.11) 9(-0.5,2.11) 10(-1,2.11)
OSC-SMD_L3.2-W1.5
  rect 1.05x1.7 smd: 1(-1.275,0) 2(1.275,0)
R0402
  rect 0.566x0.54 smd: 1(-0.433,0) 2(0.433,0)
SOD-323_L1.8-W1.3-LS2.5-RD
  rect 1x0.75 smd: 1(-1.173,0) 2(1.173,0)
SOT-23-5_L3.0-W1.7-P0.95-LS2.8-BR
  rect 1.1x0.6 smd: 1(1.3,-0.95) 2(1.3,0) 3(1.3,0.95) 4(-1.3,0.95) 5(-1.3,-0.95)
SOT-23_L2.9-W1.3-P1.90-LS2.4-BR
  rect 1x0.8 smd: 1(1.15,-0.95) 2(1.15,0.95) 3(-1.15,0)
SW-SMD_4P-L5.2-W5.2-P3.70-LS6.4
  rect 1.58x0.8 smd: 1(-3,1.85) 2(3,1.85) 3(-3,-1.85) 4(3,-1.85)
SW-SMD_L3.9-W3.0-P4.45
  rect 1.23x1.36 smd: 1(-2.185,0) 2(2.185,0)
SW-TH_XKB5858-Z-E
  round 1.6 hole 1: 1(-3.05,1.5) 2(-3.05,-0.5) 3(3.05,1.5) 4(3.05,-0.5) 5(-1,-1.5) 6(1,-1.5)
TSOT-23-5_L2.9-W1.6-P0.95-LS2.8-BL
  rect 0.532x1.045 smd: 1(-0.95,-1.147) 2(0,-1.147) 3(0.95,-1.147) 4(0.95,1.147) 5(-0.95,1.147)
USB-C-SMD_KH-TYPE-C-16P
  oval 1x2 hole 0.6x1.7: 1(-4.32,1.765) 2(4.32,1.765)
  oval 1x1.8 hole 0.6x1.4: 3(-4.32,-2.415) 4(4.32,-2.415)
  rect 0.3x1.5 smd: A1(-3.35,2.6) A4(-2.55,2.6) A5(-1.25,2.6) A6(-0.25,2.6) A7(0.25,2.6) A8(1.25,2.6) A9(2.55,2.6) A12(3.35,2.6) B1(3.05,2.6) B4(2.25,2.6) B5(1.75,2.6) B6(0.75,2.6) B7(-0.75,2.6) B8(-1.75,2.6) B9(-2.25,2.6) B12(-3.05,2.6)
WIFIM-SMD_38P-L19.2-W18.0-P1.27
  rect 0.95x2.1 smd: 1(9.045,9) 2(7.775,9) 3(6.505,9) 4(5.235,9) 5(3.965,9) 6(2.695,9) 7(1.425,9) 8(0.155,9) 9(-1.115,9) 10(-2.385,9) 11(-3.655,9) 12(-4.925,9) 13(-6.195,9) 14(-7.465,9) 25(-7.465,-9) 26(-6.195,-9) 27(-4.925,-9) 28(-3.655,-9) 29(-2.385,-9) 30(-1.115,-9) 31(0.155,-9) 32(1.425,-9) 33(2.695,-9) 34(3.965,-9) 35(5.235,-9) 36(6.505,-9) 37(7.775,-9) 38(9.045,-9)
  rect 2.1x0.95 smd: 15(-9.045,5.715) 16(-9.045,4.445) 17(-9.045,3.175) 18(-9.045,1.905) 19(-9.045,0.635) 20(-9.045,-0.635) 21(-9.045,-1.905) 22(-9.045,-3.175) 23(-9.045,-4.445) 24(-9.045,-5.715)
  rect 3.8x3.8 smd: 39(1.321,1.51)

## Nets
As in the schematic.

Pads without a net: SW1 1 3 5 6; SW3 1 4; U5 1 4 5 6 7 8 10 11 12 14 16 17 18 19 20 21 22 23 24 30 31 32 37; U6 1 7 8 10 12 13 21 22 23 24; USB1 A8 B8

## Via types
v1: diameter 0.61, hole 0.305, Top Layer to Bottom Layer, 40 vias

## Routing (per net, layer and track width the routed paths; a pad name or vN(x,y) marks a point on that pad's centre or on a via; arc(x,y) is an arc through that point)
GND:
  vias: v1(5.44,15.6) v1(5.44,5.44) v1(8.64,26.54) v1(9.02,21.46) v1(10.96,27.08) v1(12.75,21.7) v1(20.68,15.6) v1(25.76,25.76) v1(25.76,15.6)
VBAT: length 12.4
  Top Layer w0.254: SW1.2 9.46,20.19 ; 9.46,20.19 9.4,20.13 9.4,18.25 C13.2 9.31,17.23 9.53,17.02 9.53,16.32 U4.3 8.38,15.18 8.38,14.35 8.2,14.17 7.06,14.17 CN1.2 6.87,13.6 v1(6.35,13.08) ; 9.46,20.19 C12.2
  Bottom Layer w0.254: v1(6.35,13.08) 6.34,13.09 R24.2
VBAT_IN: length 26.3
  Top Layer w0.254: v1(18.17,11.56) 18.17,10.92 Q1.3
  Inner1 w0.254: SW1.4 7.61,25.4 17.65,25.4 18.17,24.88 v1(18.17,11.56)
VBUS: length 16.3
  Top Layer w0.254: USB1.A9 7.52,2.95 6.45,2.95 6.1,3.3 6.1,7.24 6.31,7.46 USB1.B9 8.85,7.46 9.14,7.75 11.78,7.75 D1.2 12.57,8.54 12.57,9.7 R10.2 R8.1
VCC_3V3: length 82.2
  Top Layer w0.254: 15.62,20.92 15.62,19.3 15.93,19 17.17,19 17.35,19.18 R18.1 17.41,19.89 20.14,19.89 20.7,20.45 R23.1 ; 15.62,20.92 C16.2 14.64,16.76 14.99,16.42 R11.2 15.06,16 v1(15.88,16) ; 15.62,20.92 15.62,20.92 U6.3 ; R7.1 26.92,11.81 26.67,12.06 24.96,12.06 24.96,11.78 25.07,11.66 25.07,11.41 24.89,11.23 24.52,11.23 24.34,11.05 R6.2 ; 17.94,4.12 17.18,4.12 U3.7 ; 17.94,4.12 17.94,4.28 18.19,4.53 18.19,5.37 17.94,5.62 17.18,5.62 U3.10 16.98,5.81 C9.1 16.99,6.74 C10.1 v1(15.88,8.01) ; 17.94,4.12 18.19,3.87 18.19,3.11 18.73,2.56 L1.1 21.47,2.56 C3.2 23.32,2.67 C1.2 C2.2 28.96,2.64 v1(29.46,3.14) ; U6.28 13.74,21.87 13.58,21.71 13.58,20.84 12.3,20.84 v1(11.81,21.34)
  Inner1 w0.254: v1(11.81,21.34) 12.52,20.63 15.31,20.63 15.88,20.07 v1(15.88,16)
  Bottom Layer w0.254: C19.2 v1(29.46,3.14) ; C19.2 28.52,3.12 C17.2 ; C19.2 28.54,3.5 27.98,4.06 27.98,4.71 U5.2 27.46,10.13 v1(26.92,10.67) ; v1(11.81,21.34) 10.47,22.68 10.47,24.76 R17.1 12.78,25.02 13.28,25.53 13.28,26.8 ; v1(15.88,8.01) v1(15.88,16)
VDD: length 17.7
  Top Layer w0.254: D1.1 15.24,8.51 15.61,8.88 Q1.2 15.8,9.91 20.72,9.91 21.19,9.44 R3.1 21.69,8.86 21.69,6.12 21.95,5.87 U2.4 22.84,5.84 23.75,5.84 24.16,6.25 24.46,6.25 24.47,6.24 C7.2 C8.2
BAT_ADC: length 12.3
  Bottom Layer w0.254: U5.13 12.97,5.74 12.97,6.39 11.61,7.75 9.47,7.75 9.31,7.92 9.31,9.4 8.05,10.66 8.05,12.23 ; R24.1 8.05,12.23 ; 8.05,12.23 R25.2
CC1: length 2.3
  Top Layer w0.254: USB1.A5 9.58,6.46 R2.1
CC2: length 2.3
  Top Layer w0.254: R5.1 9.57,3.46 USB1.B5
D+: length 2.1
  Top Layer w0.254: U3.1 12.86,5.71 11.56,5.71 11.43,5.59 R13.2
D-: length 2.4
  Top Layer w0.254: R14.2 11.73,5.2 U3.2
EN: length 33.1
  Top Layer w0.254: v1(29.13,10.85) 29.13,9.58 28.89,9.33 C4.2 27.9,10.52 R7.2 27.94,10.78 SW2.1 ; U3.4 13.64,4.2 13.97,4.53 13.97,6.4 13.88,6.49 13.88,6.97 14.48,7.58 15.46,7.58 15.81,7.24 15.81,7.05 v1(16,6.86)
  Bottom Layer w0.254: 26.19,6.32 U5.3 26.29,5.32 26.29,6.22 26.19,6.32 ; 26.19,6.32 26.19,6.83 ; 26.19,6.83 25.15,7.87 17.02,7.87 v1(16,6.86) ; 26.19,6.83 26.19,10.76 26.68,11.25 28.75,11.25 29.13,10.87 v1(29.13,10.85)
INT: length 5.2
  Top Layer w0.254: v1(15.88,24.77) 16.45,25.34 16.87,25.34 16.89,25.37 U6.14
  Bottom Layer w0.254: v1(15.88,24.77) 15.66,24.55 14.17,24.55 14.01,24.39 14.01,23.74 U5.26
IO0: length 30
  Top Layer w0.254: v1(14.71,3.72) 14.74,3.68 17.05,3.68 17.08,3.65 17.08,2.6 16.64,2.16 R12.2
  Inner1 w0.254: v1(14.71,3.72) 11.52,3.72 11.05,4.19 v1(11.05,23.75)
  Bottom Layer w0.254: U5.25 12.21,23.22 11.68,23.75 v1(11.05,23.75)
IO33: length 13.2
  Top Layer w0.254: v1(19.18,7.29) v1(19.18,9.02) ; v1(16.76,12.7) 15.92,13.54 SW3.2 15.88,13.82 15.88,14.81 15.7,14.99 15.06,14.99 R11.1
  Bottom Layer w0.254: v1(16.76,12.7) 16.76,9.65 17.4,9.02 v1(19.18,9.02) ; U5.9 19.09,5.74 19.09,6.39 19.18,6.48 v1(19.18,7.29)
LED1: length 28.7
  Inner1 w0.254: v1(15.02,23.95) 16.69,23.95 17.4,23.24 17.4,4.19 16.1,2.89 v1(11.99,2.89)
  Bottom Layer w0.254: R1.2 v1(11.99,2.89)
LED2: length 46.8
  Top Layer w0.254: v1(17.27,1.41) 28.56,1.41 30.05,2.9 30.05,3.55 30.05,3.56 30.05,7.28 29.72,7.62 v1(29.72,7.87)
  Inner1 w0.254: v1(20.07,20.9) 28.63,20.9 29.72,19.81 v1(29.72,7.87)
  Bottom Layer w0.254: U5.29 17.3,21.18 17.58,20.9 v1(20.07,20.9) ; U1.1 v1(17.27,1.41)
RESET: length 5.5
  Top Layer w0.254: v1(16.13,23.24) 16.13,23.75 16.25,23.87 U6.11 18.64,23.87 C21.2 19.27,24.5 20.7,24.5
  Bottom Layer w0.254: U5.28 16.05,23.24 v1(16.13,23.24)
RXD0: length 29.1
  Top Layer w0.254: v1(14.46,6.73) 14.46,5.1 14.86,4.7 U3.8
  Bottom Layer w0.254: U5.34 23.65,20.86 23.11,20.32 15.62,20.32 14.46,19.16 v1(14.46,6.73)
SCL: length 15.9
  Top Layer w0.254: v1(16,26.88) 15.57,26.88 15.12,26.43 U6.19
  Bottom Layer w0.254: 14.15,26.8 14.23,26.88 v1(16,26.88) 16.97,25.91 24.77,25.91 26.19,24.48 U5.36
SDA: length 15.2
  Top Layer w0.254: v1(22.38,21.59) v1(22.38,24.89) ; v1(13.87,26.2) 13.99,26.2 U6.20
  Bottom Layer w0.254: U5.33 v1(22.38,21.59) ; v1(22.38,24.89) 21.87,25.4 14.66,25.4 14.15,25.91 ; v1(13.87,26.2) 14.15,25.91 ; 14.15,25.91 R19.1
TXD0: length 28.3
  Top Layer w0.254: v1(15.22,7) 15.22,5.86 15.88,5.2 U3.9
  Bottom Layer w0.254: v1(15.22,7) 15.22,15.51 15.27,15.55 15.27,18.57 16,19.3 24.13,19.3 24.92,20.09 U5.35
USB_D+: length 5.2
  Top Layer w0.254: R13.1 v1(9.14,5.59) 9.01,5.46 USB1.A6 ; USB1.B6 8.76,4.46 v1(9.13,4.09)
  Inner1 w0.254: v1(9.13,4.09) 9.14,4.11 v1(9.14,5.59)
USB_D-: length 5.2
  Top Layer w0.254: R14.1 9.34,4.96 USB1.A7 7.01,4.96 6.78,5.19 6.78,5.72 7.02,5.97 7.8,5.97 USB1.B7
VUSB: length 8.5
  Top Layer w0.254: C15.2 9.59,11.49 9.74,11.65 C14.2 9.78,12.36 9.78,12.83 9.53,13.08 9.46,13.08 U4.4 9.46,14.8 9.72,15.05 R15.2
$2N9985: length 4
  Top Layer w0.254: X1.2 12.28,22.47 C11.1 13.48,22.37 U6.27
$2N9991: length 4.7
  Top Layer w0.254: U6.26 14.04,22.87 13.78,23.13 13.78,23.64 C18.1 12.4,25.02 X1.1
$2N10003: length 1.8
  Top Layer w0.254: U6.9 17.45,22.86 18.29,22.86 18.43,22.71 C20.2
$2N10010: length 1.6
  Top Layer w0.254: U6.4 16.12,20.3 R18.2
$2N10051: length 3.2
  Top Layer w0.254: R12.1 13.08,2.16 12.88,2.36 U3.5
$2N10058: length 5.3
  Top Layer w0.254: v1(12.32,19.3) 11.52,18.5 LED1.1 ; v1(12.32,16.64) 11.94,16.26 U4.1
  Bottom Layer w0.254: v1(12.32,16.64) v1(12.32,19.3)
$2N10059: length 2.3
  Top Layer w0.254: R15.1 13.34,17.94 LED1.2
$2N10065: length 2
  Top Layer w0.254: R16.1 12.65,13.97 U4.5
$2N10075: length 2
  Top Layer w0.254: L1.2 20.22,4.18 U2.3
$2N10079: length 4.6
  Top Layer w0.254: U2.5 23.5,8.45 R9.1 23.48,9.13 R6.1 23.56,10.58 C5.1
$2N10081: length 1.6
  Top Layer w0.254: R3.2 20.33,7.87 U2.1
$2N10082: length 1.6
  Top Layer w0.254: Q1.1 15.55,11.68 R8.2
$2N10121: length 1.7
  Bottom Layer w0.254: R17.2 9.87,25.03 LED2.2
$2N14287: length 1.8
  Bottom Layer w0.254: R1.1 13.89,2.91 U1.3
$2N14330: length 1.8
  Bottom Layer w0.254: R4.2 15.6,1.37 U1.4

## Copper pours and planes (outline as drawn; the poured copper is in the pictures)
GND on Top Layer: -2.79,30.61 32.26,30.61 32.26,-2.41 -2.79,-2.41
GND on Bottom Layer: -3.68,31.5 37.72,31.5 37.72,-3.3 -3.68,-3.3
GND on Inner1: -7.37,33.53 38.61,33.53 38.61,-4.32 -7.37,-4.32
GND on Inner2: 0.26,27.43 30.22,27.43 30.22,0.26 0.26,0.26

Small or netless copper shapes (teardrops, artwork), in the pictures only: 14 on Inner2

## Text on the board
Top Silkscreen Layer: Isaac | Pure
